# EAGLE schematic nodemcu (EAGLE 9.5.0)
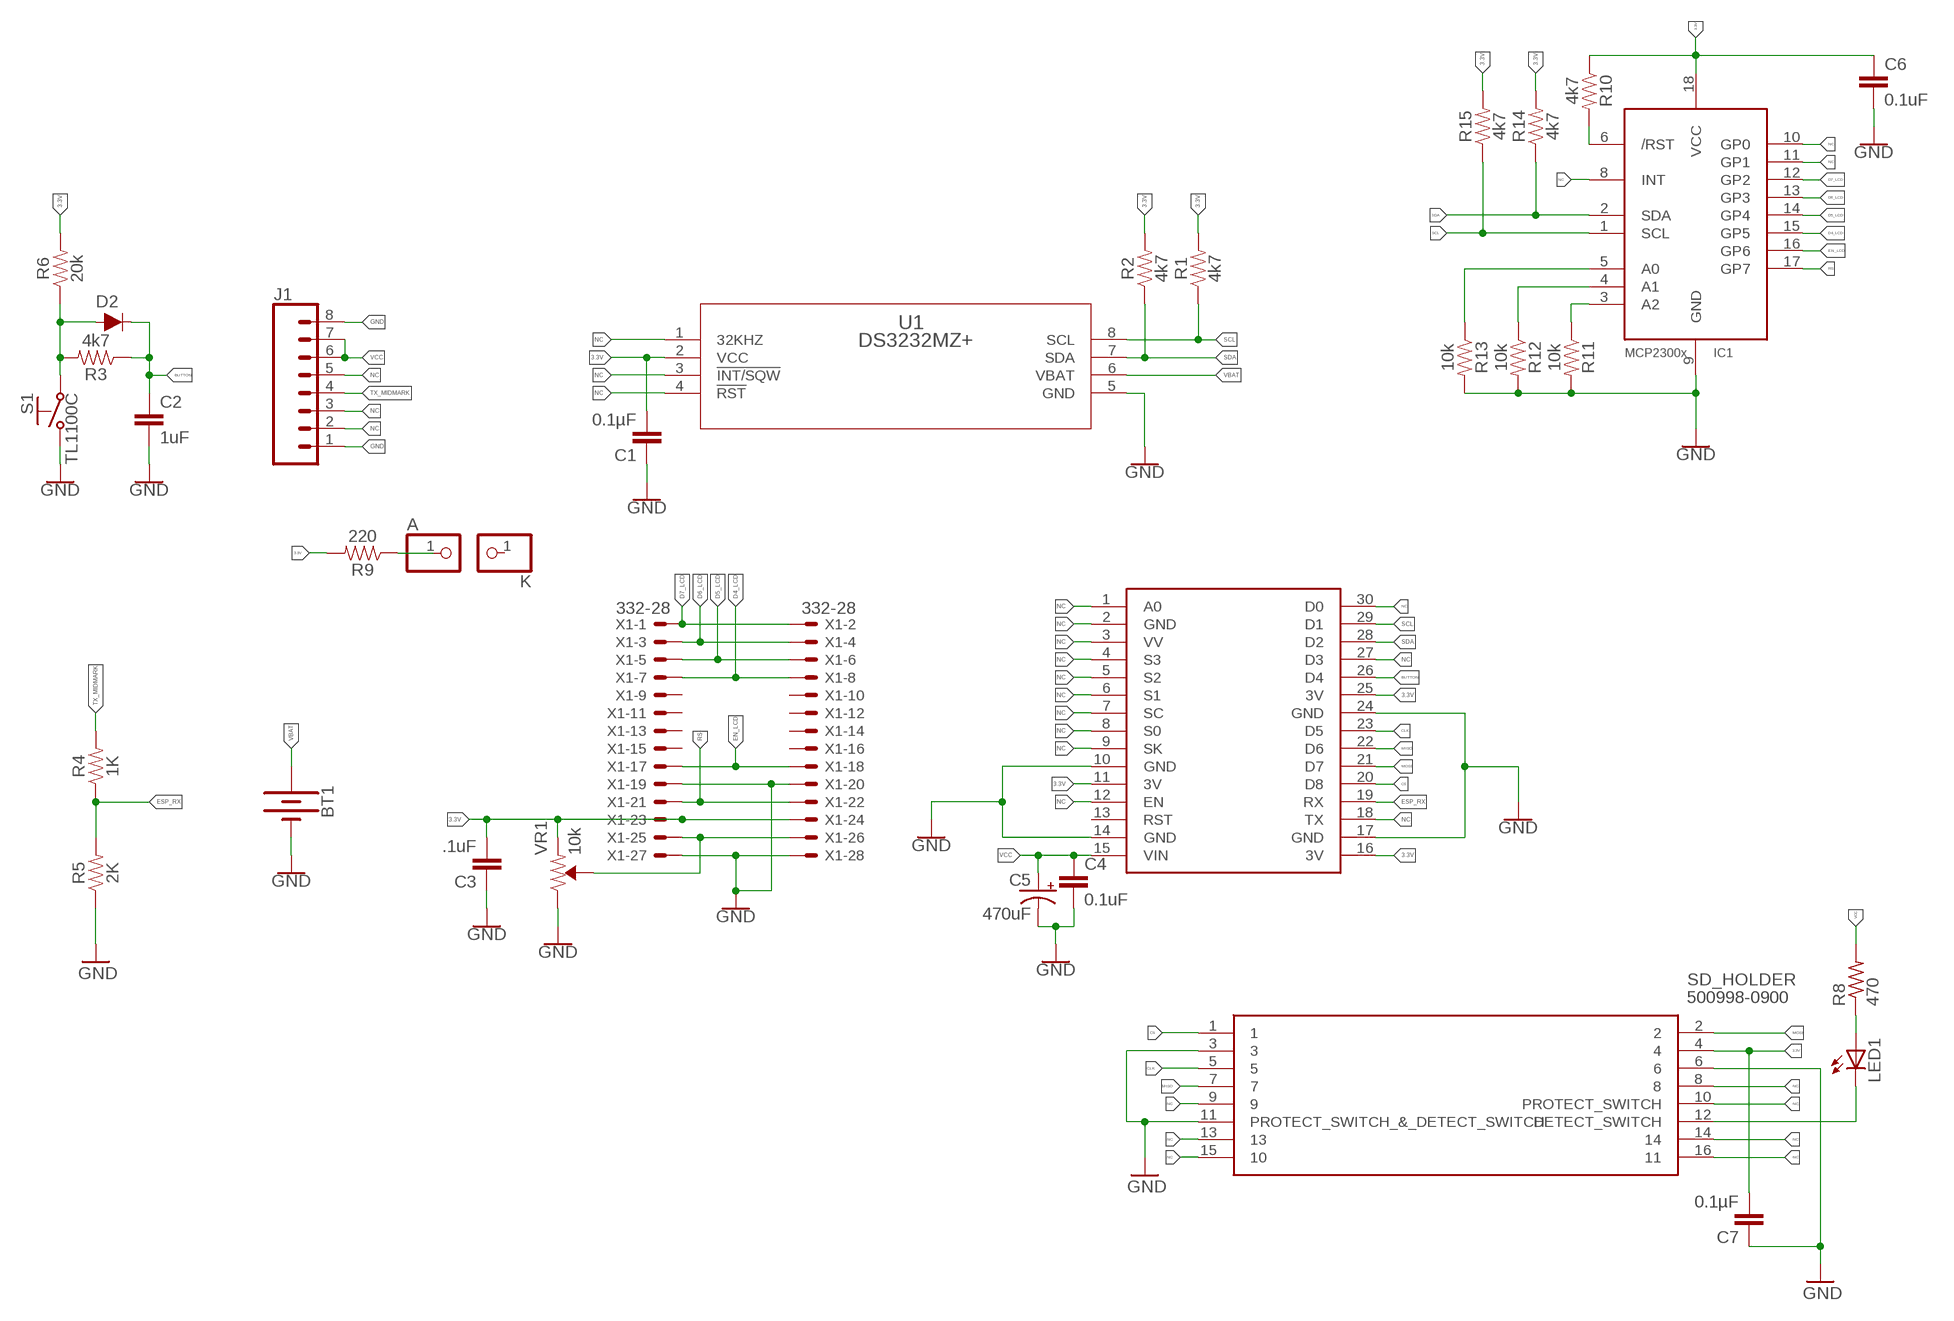
[diagram p0: schematic, sheet 1]

## Parts
A  PINHD-1X1  [1X01]
BT1  BATTERY-20MM_PTH  [BATTCOM_20MM_PTH]
C1  0.1µF  0.33UF/330NF-0805-50V-10%  [0805]
C2  1uF  1.0UF-0805-25V-10%  [0805]
C3  .1uF  1.0UF-0805-25V-10%  [0805]
C4  0.1uF  1.0UF-0805-25V-10%  [0805]
C5  470uF  100UF-POLAR-10X10.5-63V-20%  [NIC_10X10.5_CAP]
C6  0.1uF  1.0UF-0805-25V-10%  [0805]
C7  0.1µF  0.33UF/330NF-0805-50V-10%  [0805]
D2  1A/50V/1.1V  DIODE-PTH  [DIODE-1N4001]
IC1  MCP23008/P  [DIL18]
J1  CONN_08"  [1X08]
K  PINHD-1X1  [1X01]
LED1  LEDSIDELED  [OSRAM-SIDELED]
R1  4k7  0.22OHM-0805-1/4W-1%  [0805]
R2  4k7  0.22OHM-0805-1/4W-1%  [0805]
R3  4k7  0.22OHM-0805-1/4W-1%  [0805]
R4  1K  0.22OHM-0805-1/4W-1%  [0805]
R5  2K  0.22OHM-0805-1/4W-1%  [0805]
R6  20k  0.22OHM-0805-1/4W-1%  [0805]
R8  470  R-US_R0805  [R0805]
R9  220  0.22OHM-0805-1/4W-1%  [0805]
R10  4k7  0.22OHM-0805-1/4W-1%  [0805]
R11  10k  0.22OHM-0805-1/4W-1%  [0805]
R12  10k  0.22OHM-0805-1/4W-1%  [0805]
R13  10k  0.22OHM-0805-1/4W-1%  [0805]
R14  4k7  0.22OHM-0805-1/4W-1%  [0805]
R15  4k7  0.22OHM-0805-1/4W-1%  [0805]
S1  TL1100C  [TL1100C]
SD_HOLDER  500998-0900  [5009980900]
U1  DS3232MZ+  [21-0041B_8]
U$1  NODEMCU  [NODEMCU]
VR1  10k  TRIMPOT-PTH-10MM-KNOB-1/2W-10%  [TRIMPOT-PTH-3386U]
X1  332-28  [332-28]

## Nets
3.3V [power]: C1.2 C3.2 C6.1 C7.2 IC1.18(VCC) R1.2 R2.2 R6.2 R9.2 R10.1 R14.2 R15.2 SD_HOLDER.4 U1.2(VCC) U$1.11(3V) U$1.16(3V) U$1.25(3V) VR1.1(CCW) X1.23 X1.24
BUTTON [power]: C2.1 D2.A D2.C R3.1 R3.2 R6.1 S1.1(P) U$1.26(D4)
CLK [signal]: SD_HOLDER.5 U$1.23(D5)
CS [signal]: SD_HOLDER.1 U$1.20(D8)
D4_LCD [signal]: IC1.15(GP5) X1.7 X1.8
D5_LCD [signal]: IC1.14(GP4) X1.5 X1.6
D6_LCD [signal]: IC1.13(GP3) X1.3 X1.4
D7_LCD [signal]: IC1.12(GP2) X1.1 X1.2
EN_LCD [signal]: IC1.16(GP6) X1.17 X1.18
ESP_RX [signal]: R4.1 R5.2 U$1.19(RX)
GND [power]: BT1.2(-) C1.1 C2.2 C3.1 C4.2 C5.- C6.2 C7.1 IC1.9(GND) J1.1 J1.8 R5.1 R11.2 R12.2 R13.2 S1.2(S) SD_HOLDER.3 SD_HOLDER.6 SD_HOLDER.11(PROTECT_SWITCH_&_DETECT_SWITCH) U1.5(GND) U$1.10(GND) U$1.14(GND) U$1.17(GND) U$1.24(GND) VR1.3(CW) X1.19 X1.20 X1.27 X1.28
MISO [signal]: SD_HOLDER.7 U$1.22(D6)
MOSI [signal]: SD_HOLDER.2 U$1.21(D7)
N$1: U$1.2(GND)
N$2: U$1.3(VV)
N$3 [power]: A.1 R9.1
N$4: IC1.6(/RST) R10.2
N$5: IC1.3(A2) R11.1
N$6 [signal]: VR1.2(WIPER) X1.25 X1.26
N$7: IC1.4(A1) R12.1
N$8: IC1.5(A0) R13.1
N$25: LED1.C SD_HOLDER.12(DETECT_SWITCH)
N$31 [power]: LED1.A R8.1
NC: IC1.8(INT) IC1.10(GP0) IC1.11(GP1) J1.2 J1.3 J1.5 SD_HOLDER.8 SD_HOLDER.9 SD_HOLDER.10(PROTECT_SWITCH) SD_HOLDER.13 SD_HOLDER.14 SD_HOLDER.15 SD_HOLDER.16 U1.1(32KHZ) U1.3(!INT/SQW) U1.4(!RST) U$1.1(A0) U$1.4(S3) U$1.5(S2) U$1.6(S1) U$1.7(SC) U$1.8(S0) U$1.9(SK) U$1.12(EN) U$1.18(TX) U$1.27(D3) U$1.30(D0)
RS [signal]: IC1.17(GP7) X1.21 X1.22
SCL [signal]: IC1.1(SCL) R1.1 R15.1 U1.8(SCL) U$1.29(D1)
SDA [signal]: IC1.2(SDA) R2.1 R14.1 U1.7(SDA) U$1.28(D2)
TX_MIDMARK [power]: J1.4 R4.2
VBAT [power]: BT1.1(+) U1.6(VBAT)
VCC [power]: C4.1 C5.+ J1.6 J1.7 R8.2 U$1.15(VIN)
Unconnected: K.1 U$1.13(RST) X1.9 X1.10 X1.11 X1.12 X1.13 X1.14 X1.15 X1.16

## Library data of the parts
A K = pinhead:PINHD-1X1: PIN HEADER
BT1 = SparkFun-Batteries:BATTERY: Battery - Single Cell A variety of battery chemistries, sizes, and footprints. Device List: 20MM_PTH - Coin Cell Battery Holder - 20mm (PTH) <https://www.sparkfun.com/products/783> 20MM_PTH_KIT- Coin Cell battery Holder - 20 mm (PTH) <http://www.sparkfun.com/products/783>kit version with special mask 6.8MM_PTH - Coin Cell Battery Holder - 6.8MM(SMD) <https://www.digikey.com/product-detail/en/seiko-instruments/MS621FE-FL11E/728-1057-ND/1889208?WT.srch=1&gclid=CNOQ5a6LzdQCFZS2wAodXCkE0g> 12MM_SMD - Coin Cell Battery Holder - 12mm (SMD) <https://www.sparkfun.com/products/10592> 12MM_PTH - Coin Cell Battery Holder - 12mm (PTH) <https://www.sparkfun.com/products/7948> 20MM_SMD - 20mm Coin Cell Battery Holder (SMD) (2 legs) Used on the Big Time Watch Kit <https://www.sparkfun.com/products/11734> 20MM_SMD_4LEGS - Coin Cell Battery Holder - 20mm (SMD) <https://www.sparkfun.com/products/11892> 20MM_SMD_4LEGS_OVERPASTE - Coin Cell Battery Holder - 20mm (SMD) <https://www.sparkfun.com/products/11892> (Over-paste on the legs) 24.5MM_PTH - Coin Cell Battery Holder - 24.5mm (PTH) <https://www.sparkfun.com/products/8863> 9V - 9V Battery Holder - PC Mount Used on the SparkFun SparkPunk Sound Kit <https://www.sparkfun.com/products/11177> and SparkFun SparkPunk Sequencer Kit <https://www.sparkfun.com/products/12707> 18650 - Battery Holder - 18650 (PTH) <https://www.sparkfun.com/products/13113> AA - Battery Holder - 1xAA (PTH) <https://www.sparkfun.com/products/7949> AAA - Battery Holder - 1xAAA (PTH) <https://www.sparkfun.com/products/12718> AA_KIT - Battery Holder - 1xAA (PTH) <https://www.sparkfun.com/products/7949> Special kit package - pads only have exposed copper on one side of the board. AAA_KIT - Battery Holder - 1xAAA (PTH) <https://www.sparkfun.com/products/12718> Special kit package - pads only have exposed copper on one side of the board.; PROD_ID: BATT-09031; SF_SKU: PRT-00783
C1 C7 = SparkFun-Capacitors:0.33UF/330NF: 0.33µF/330nF ceramic capacitors A capacitor is a passive two-terminal electrical component used to store electrical energy temporarily in an electric field.; PROD_ID: CAP-08469; VALUE: 0.33µF
C2-C4 C6 = SparkFun-Capacitors:1.0UF: 1µF ceramic capacitors A capacitor is a passive two-terminal electrical component used to store electrical energy temporarily in an electric field.; PROD_ID: CAP-08064; VALUE: 1.0uF
C5 = SparkFun-Capacitors:100UF-POLAR: 100µF polarized capacitors A capacitor is a passive two-terminal electrical component used to store electrical energy temporarily in an electric field.; PROD_ID: CAP-08362; VALUE: 100uF
D2 = SparkFun-DiscreteSemi:DIODE: Diode These are standard reverse protection diodes and small signal diodes. SparkFun Products: SparkFun SparkPunk Sound Kit <https://www.sparkfun.com/products/11177> SparkFun ESP8266 Thing <https://www.sparkfun.com/products/13231>; PROD_ID: DIO-09176
IC1 = adafruit:MCP23008: MCP23008 Inexpensive i2c i/o expander - 8 general purpose i/o pins with optional pullups
J1 = SparkFun-Connectors:CONN_08: Multi connection point. Often used as Generic Header-pin footprint for 0.1 inch spaced/style header connections On any of the 0.1 inch spaced packages, you can populate with these: Break Away Headers - Straight <https://www.sparkfun.com/products/116> (PRT-00116) Break Away Male Headers - Right Angle <https://www.sparkfun.com/products/553> (PRT-00553) Female Headers <https://www.sparkfun.com/products/115> (PRT-00115) Break Away Headers - Machine Pin <https://www.sparkfun.com/products/117> (PRT-00117) Break Away Female Headers - Swiss Machine Pin <https://www.sparkfun.com/products/743> (PRT-00743) Arduino Stackable Header - 8 Pin <https://www.sparkfun.com/products/9279> (PRT-09279) For SCREWTERMINALS and SPRING TERMINALS visit here: Screw Terimnals on SparkFun.com <https://www.sparkfun.com/search/results?term=Screw+Terminals> (5mm/3.5mm/2.54mm spacing) This device is also useful as a general connection point to wire up your design to another part of your project. Our various solder wires solder well into these plated through hole pads. Hook-Up Wire - Assortment (Stranded, 22 AWG) <https://www.sparkfun.com/products/11375> (PRT-11375) Hook-Up Wire - Assortment (Solid Core, 22 AWG) <https://www.sparkfun.com/products/11367> (PRT-11367) View the entire wire category on our website here <https://www.sparkfun.com/categories/141> Special notes: Molex polarized connector foot print use with SKU : PRT-08231 with associated crimp pins and housings. 1MM SMD Version SKU: PRT-10208 NOTES ON THE VARIANTS LOCK and LOCK_LONGPADS... This footprint was designed to help hold the alignment of a through-hole component (i.e. 6-pin header) while soldering it into place. You may notice that each hole has been shifted either up or down by 0.005 of an inch from it's more standard position (which is a perfectly straight line). This slight alteration caused the pins (the squares in the middle) to touch the edges of the holes. Because they are alternating, it causes a "brace" to hold the component in place. 0.005 has proven to be the perfect amount of "off-center" position when using our standard breakaway headers. Although looks a little odd when you look at the bare footprint, once you have a header in there, the alteration is very hard to notice. Also,if you push a header all the way into place, it is covered up entirely on the bottom side.; PROD_ID: CONN-08438
LED1 = adafruit:LED: LED OSRAM: - CHIPLED LG R971, LG N971, LY N971, LG Q971, LY Q971, LO R971, LY R971 LH N974, LH R974 LS Q976, LO Q976, LY Q976 LO Q996 - Hyper CHIPLED LW Q18S LB Q993, LB Q99A, LB R99A - SideLED LS A670, LO A670, LY A670, LG A670, LP A670 LB A673, LV A673, LT A673, LW A673 LH A674 LY A675 LS A676, LA A676, LO A676, LY A676, LW A676 LS A679, LY A679, LG A679 - Hyper Micro SIDELED® LS Y876, LA Y876, LO Y876, LY Y876 LT Y87S - SmartLED LW L88C, LW L88S LB L89C, LB L89S, LG L890 LS L89K, LO L89K, LY L89K LS L896, LA L896, LO L896, LY L896 - TOPLED LS T670, LO T670, LY T670, LG T670, LP T670 LSG T670, LSP T670, LSY T670, LOP T670, LYG T670 LG T671, LOG T671, LSG T671 LB T673, LV T673, LT T673, LW T673 LH T674 LS T676, LA T676, LO T676, LY T676, LB T676, LH T676, LSB T676, LW T676 LB T67C, LV T67C, LT T67C, LS T67K, LO T67K, LY T67K, LW E67C LS E67B, LA E67B, LO E67B, LY E67B, LB E67C, LV E67C, LT E67C LW T67C LS T679, LY T679, LG T679 LS T770, LO T770, LY T770, LG T770, LP T770 LB T773, LV T773, LT T773, LW T773 LH T774 LS E675, LA E675, LY E675, LS T675 LS T776, LA T776, LO T776, LY T776, LB T776 LHGB T686 LT T68C, LB T68C - Hyper Mini TOPLED® LB M676 - Mini TOPLED Santana® LG M470 LS M47K, LO M47K, LY M47K Source: http://www.osram.convergy.de/
R1-R6 R9-R15 = SparkFun-Resistors:0.22OHM: 0.22Ω resistor A resistor is a passive two-terminal electrical component that implements electrical resistance as a circuit element. Resistors act to reduce current flow, and, at the same time, act to lower voltage levels within circuits. - Wikipedia; PROD_ID: RES-09883; VALUE: 0.22
R8 = rcl:R-US_: RESISTOR, American symbol; SPICEPREFIX: R
S1 = switch-e-switch:TL1100C: TACTILE SWITCH
SD_HOLDER = SamacSys_Parts:500998-0900: 9 way normal mount SD card connector 9 way normal mount SD card connector Source: Datasheet <https://componentsearchengine.com/Datasheets/1/500998-0900.pdf>; ALLIED_NUMBER: 70266950; ALLIED_PRICE-STOCK: https://www.alliedelec.com/molex-incorporated-500998-0900/70266950/; DESCRIPTION: 9 way normal mount SD card connector 9 way normal mount SD card connector; HEIGHT: 3mm; MANUFACTURER_NAME: Molex; MANUFACTURER_PART_NUMBER: 500998-0900; MOUSER_PART_NUMBER: 538-500998-0900; MOUSER_PRICE-STOCK: https://www.mouser.com/Search/Refine.aspx?Keyword=538-500998-0900; RS_PART_NUMBER: 4879327; RS_PRICE-STOCK: http://uk.rs-online.com/web/p/products/4879327
U1 = ds3232:DS3232MZ+: DS3232; BUILT_BY: EMA_UL_Team; MANUFACTURER_PART_NUMBER: DS3232MZ+; VENDOR: Maxim Integrated Products
U$1 = nodemcu:NODEMCU
VR1 = SparkFun-Resistors:TRIMPOT: Trimming Potentiometer (Trimpot) Three-terminal potentiometers, with an adjustable wiper and two adjustable resistors. A pot can be used to create a configurable voltage divider, or as a variable resistor. "Trimpots" are a subset of potentiometers, usually intended for "set-and-forget" applications. They're often more delicate than standard potentiometers - rated for fewer turns. Variants PTH-KNOB - PTH Trimpot w/ finger-adjustable knob Trimpot 10K with Knob <https://www.sparkfun.com/products/9806> (COM-09806) Datasheet <http://www.sparkfun.com/datasheets/Components/General/TSR-3386.pdf> SMD-3MM-CLOSED-FRAME - SMD 3mm Square Closed-Frame Trimpot Used on e.g. EasyDriver - Stepper Motor Driver <https://www.sparkfun.com/products/12779> Datasheet <http://www.bitechnologies.com/pdfs/22.pdf> (22AR10KTR) SMD-5MM - SMD 5mm Square Closed-Frame Trimpot Used on e.g. IOIO-OTG - V2.2 <https://www.sparkfun.com/products/13613> Datasheet <http://www.vishay.com/docs/51008/ts53.pdf> (TS53YL502MR10) SMD-3MM-1/10W-25% - 3mm Square Open-Frame Trimpot Used on e.g. SparkFun Shapeoko <https://www.sparkfun.com/products/13899> Datasheet <http://www.bourns.com/docs/Product-Datasheets/TC33.pdf> (TC33X-2-103E); PROD_ID: RES-09730; SF_SKU: COM-09806
X1 = con-garry:332-28: 28 Pin - 2mm Dual Row Source: www.mpe-connector.de / garry_shortform_2012.pdf

## Net classes
1 signal: width 0.254 mm, drill 0.305 mm, clearance 0.254 mm
2 power: width 0.508 mm, drill 0.61 mm, clearance 0.254 mm